# EAGLE schematic main (EAGLE 7.7.0)
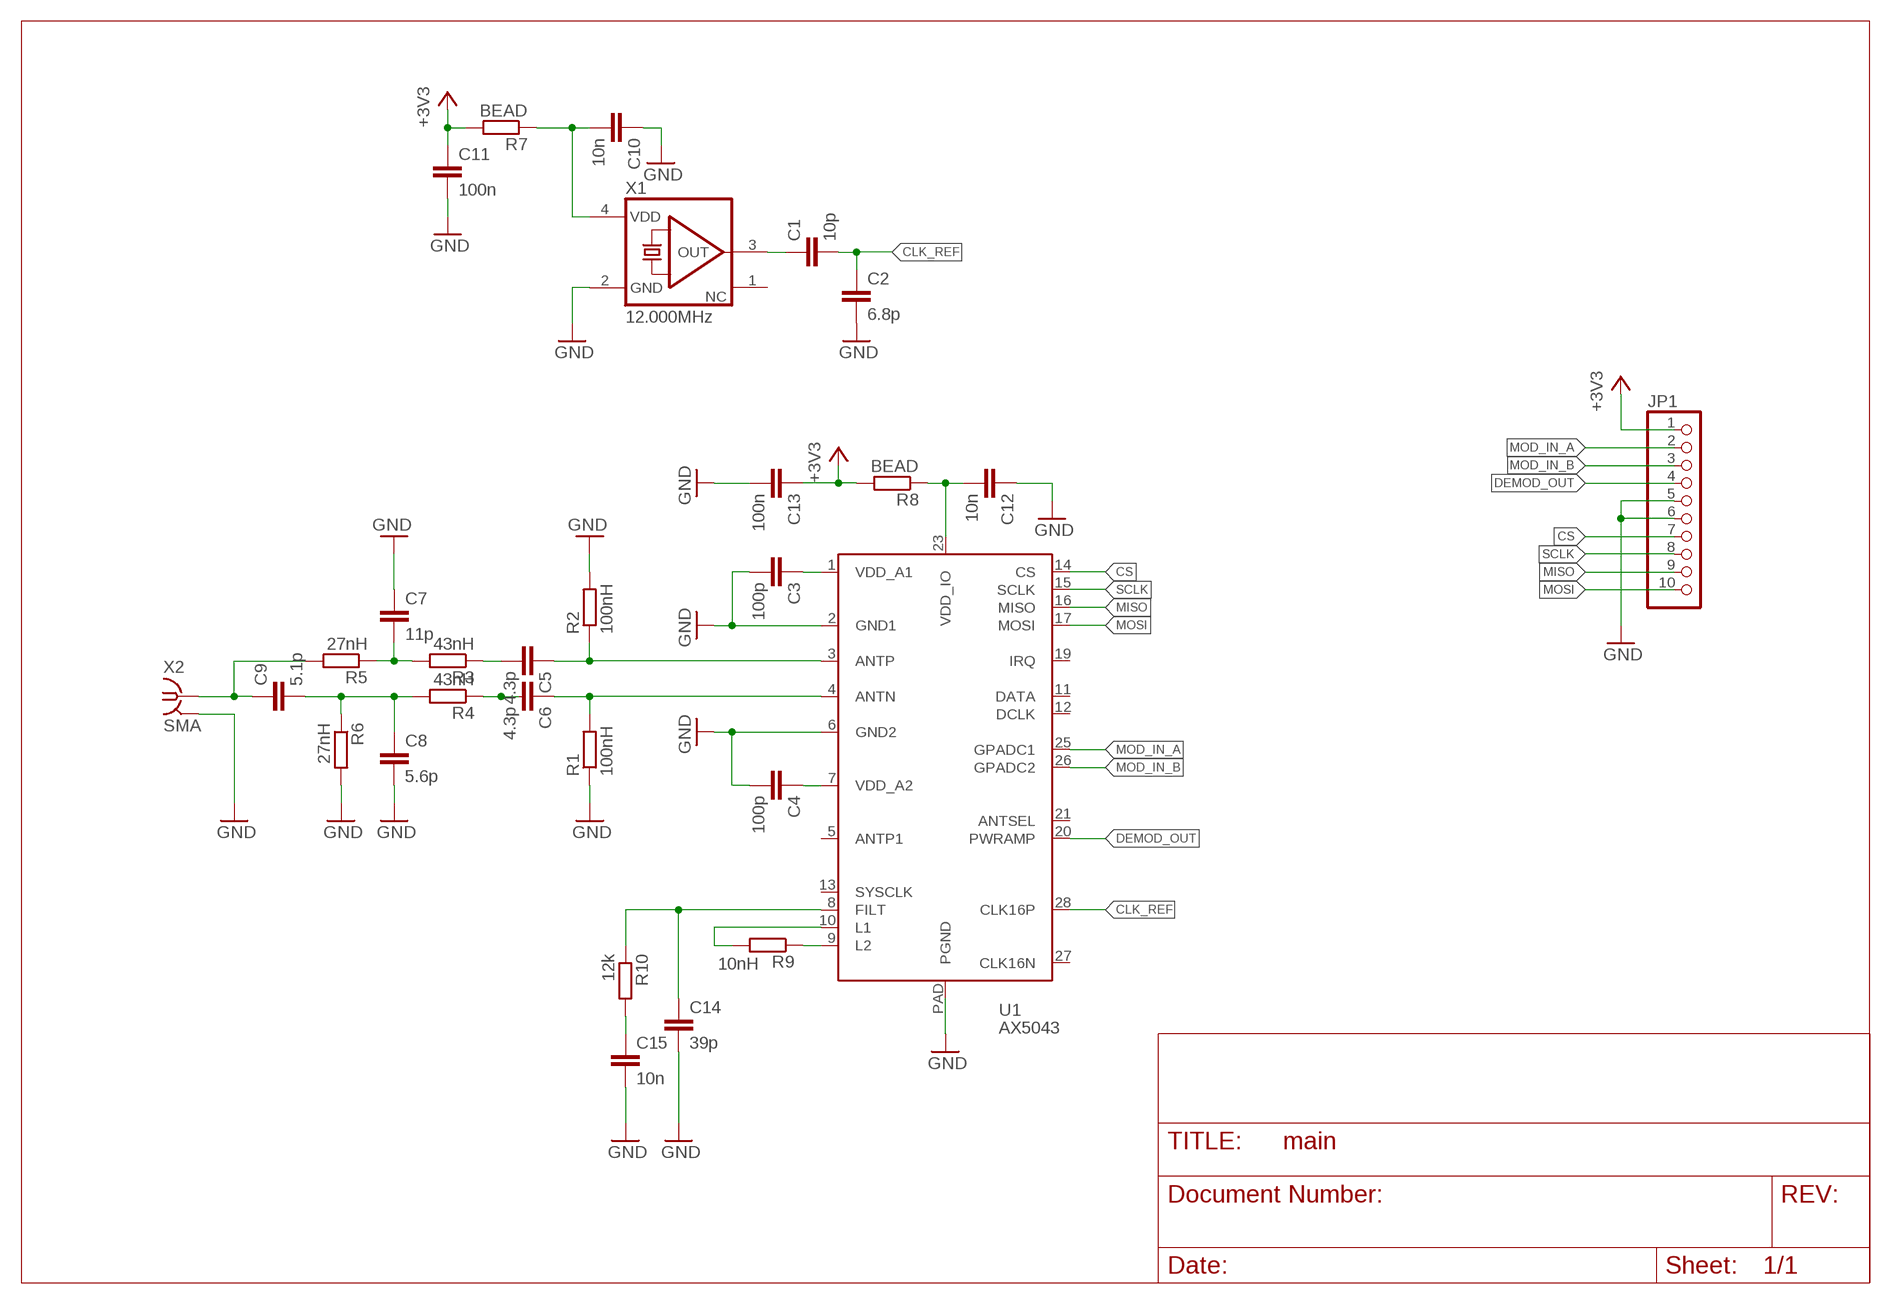
[diagram p0: schematic, sheet 1]

## Parts
C1  10p  C-EUC0603  [C0603]
C2  6.8p  C-EUC0603  [C0603]
C3  100p  C-EUC0603  [C0603]
C4  100p  C-EUC0603  [C0603]
C5  4.3p  C-EUC0603  [C0603]
C6  4.3p  C-EUC0603  [C0603]
C7  11p  C-EUC0603  [C0603]
C8  5.6p  C-EUC0603  [C0603]
C9  5.1p  C-EUC0603  [C0603]
C10  10n  C-EUC0603  [C0603]
C11  100n  C-EUC0603  [C0603]
C12  10n  C-EUC0603  [C0603]
C13  100n  C-EUC0603  [C0603]
C14  39p  C-EUC0603  [C0603]
C15  10n  C-EUC0603  [C0603]
JP1  PINHD-1X10  [1X10]
R1  100nH  R-EU_R0603  [R0603]
R2  100nH  R-EU_R0603  [R0603]
R3  43nH  R-EU_R0603  [R0603]
R4  43nH  R-EU_R0603  [R0603]
R5  27nH  R-EU_R0603  [R0603]
R6  27nH  R-EU_R0603  [R0603]
R7  BEAD  R-EU_R0603  [R0603]
R8  BEAD  R-EU_R0603  [R0603]
R9  10nH  R-EU_R0603  [R0603]
R10  12k  R-EU_R0603  [R0603]
U1  AX5043  U-ONSEMI-AX5043  [QFN28-5X5-WITH-CENTER-PAD]
X1  12.000MHz  ASE  [ASE]
X2  SMA  SMA-142-0711-821/826  [J502-ND-142-0711-821/826]

## Nets
+3V3: C11.1 C13.1 JP1.1 R7.2 R8.2
CLK_REF: C1.2 C2.1 U1.28(CLK16P)
CS: JP1.7 U1.14(CS)
DEMOD_OUT: JP1.4 U1.20(PWRAMP)
GND: C2.2 C3.2 C4.2 C7.1 C8.2 C10.1 C11.2 C12.1 C13.2 C14.2 C15.2 JP1.5 JP1.6 R1.1 R2.2 R6.2 U1.2(GND1) U1.6(GND2) U1.PAD(PGND) X1.2(GND) X2.G@1 X2.G@2 X2.G@3 X2.G@4
MISO: JP1.9 U1.16(MISO)
MOD_IN_A: JP1.2 U1.25(GPADC1)
MOD_IN_B: JP1.3 U1.26(GPADC2)
MOSI: JP1.10 U1.17(MOSI)
N$1: C5.1 R2.1 U1.3(ANTP)
N$2: C6.1 R1.2 U1.4(ANTN)
N$3: C12.2 R8.1 U1.23(VDD_IO)
N$6: C6.2 R4.1
N$7: C4.1 U1.7(VDD_A2)
N$8: C3.1 U1.1(VDD_A1)
N$9: C1.1 X1.3(OUT)
N$10: C5.2 R3.1
N$11: C10.2 R7.1 X1.4(VDD)
N$12: C8.1 C9.2 R4.2 R6.1
N$13: C7.2 R3.2 R5.1
N$14: C9.1 R5.2 X2.1
N$15: R9.1 U1.9(L2)
N$16: R9.2 U1.10(L1)
N$17: C14.1 R10.1 U1.8(FILT)
N$19: C15.1 R10.2
SCLK: JP1.8 U1.15(SCLK)
Unconnected: U1.5(ANTP1) U1.11(DATA) U1.12(DCLK) U1.13(SYSCLK) U1.19(IRQ) U1.21(ANTSEL) U1.27(CLK16N) X1.1(NC)

## Library data of the parts
C1-C15 = rcl:C-EU: CAPACITOR, European symbol
JP1 = pinhead:PINHD-1X10: PIN HEADER
R1-R10 = rcl:R-EU_: RESISTOR, European symbol
U1 = AX5043-radio:U-ONSEMI-AX5043
X1 = ILSI_tcxo:ASE: 2.5 mm x 3.2 mm Ceramic Package SMD TCXO ILSI I547-2P3-32.0000MHz; OC_FARNELL: unknown; OC_NEWARK: unknown
X2 = con-coax:SMA-: SMA 50 Ohm End Launch Jack Receptacle - Round Contact Johnson Components Source: www.johnsoncomponents.com .. J502-ND.pdf; MF: JOHNSON COMPONENTS; MPN: 142-0711-821; OC_FARNELL: 1019328; OC_NEWARK: 16F3627